# Altium schematic sheet Bank35.SchDoc
size A3; SheetNumber: 8; SheetTotal: 9
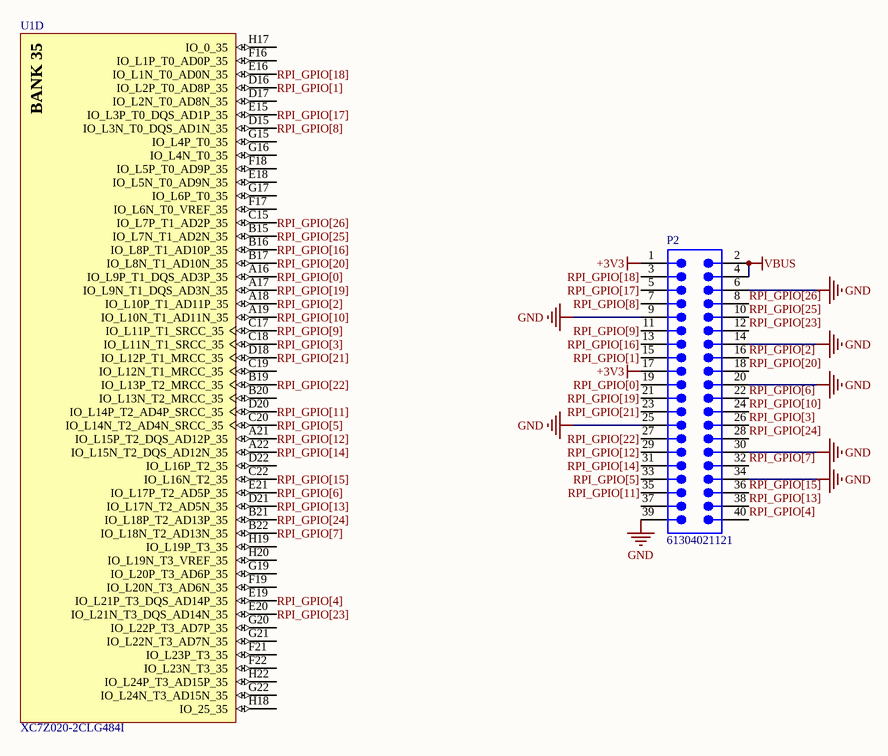
[diagram p0: Bank35.SchDoc]

## Parts
P2  61304021121  [61304021121]
U1  XC7Z020-2CLG484I  [CLG484]  (part D of 10)

## Nets
+3V3: P2.1 P2.17
GND: P2.6 P2.9 P2.14 P2.20 P2.25 P2.30 P2.34 P2.39
VBUS: P2.2 P2.4
RPI_GPIO[0]: P2.19 U1.A16(IO_L9P_T1_DQS_AD3P_35)
RPI_GPIO[1]: P2.15 U1.D16(IO_L2P_T0_AD8P_35)
RPI_GPIO[2]: P2.16 U1.A18(IO_L10P_T1_AD11P_35)
RPI_GPIO[3]: P2.26 U1.C18(IO_L11N_T1_SRCC_35)
RPI_GPIO[4]: P2.40 U1.E19(IO_L21P_T3_DQS_AD14P_35)
RPI_GPIO[5]: P2.33 U1.C20(IO_L14N_T2_AD4N_SRCC_35)
RPI_GPIO[6]: P2.22 U1.E21(IO_L17P_T2_AD5P_35)
RPI_GPIO[7]: P2.32 U1.B22(IO_L18N_T2_AD13N_35)
RPI_GPIO[8]: P2.7 U1.D15(IO_L3N_T0_DQS_AD1N_35)
RPI_GPIO[9]: P2.11 U1.C17(IO_L11P_T1_SRCC_35)
RPI_GPIO[10]: P2.24 U1.A19(IO_L10N_T1_AD11N_35)
RPI_GPIO[11]: P2.35 U1.D20(IO_L14P_T2_AD4P_SRCC_35)
RPI_GPIO[12]: P2.29 U1.A21(IO_L15P_T2_DQS_AD12P_35)
RPI_GPIO[13]: P2.38 U1.D21(IO_L17N_T2_AD5N_35)
RPI_GPIO[14]: P2.31 U1.A22(IO_L15N_T2_DQS_AD12N_35)
RPI_GPIO[15]: P2.36 U1.C22(IO_L16N_T2_35)
RPI_GPIO[16]: P2.13 U1.B16(IO_L8P_T1_AD10P_35)
RPI_GPIO[17]: P2.5 U1.E15(IO_L3P_T0_DQS_AD1P_35)
RPI_GPIO[18]: P2.3 U1.E16(IO_L1N_T0_AD0N_35)
RPI_GPIO[19]: P2.21 U1.A17(IO_L9N_T1_DQS_AD3N_35)
RPI_GPIO[20]: P2.18 U1.B17(IO_L8N_T1_AD10N_35)
RPI_GPIO[21]: P2.23 U1.D18(IO_L12P_T1_MRCC_35)
RPI_GPIO[22]: P2.27 U1.B19(IO_L13P_T2_MRCC_35)
RPI_GPIO[23]: P2.12 U1.E20(IO_L21N_T3_DQS_AD14N_35)
RPI_GPIO[24]: P2.28 U1.B21(IO_L18P_T2_AD13P_35)
RPI_GPIO[25]: P2.10 U1.B15(IO_L7N_T1_AD2N_35)
RPI_GPIO[26]: P2.8 U1.C15(IO_L7P_T1_AD2P_35)

Not connected (* = marked no-connect by the designer): P2 37; U1 B20(IO_L13N_T2_MRCC_35) C19(IO_L12N_T1_MRCC_35) D17(IO_L2N_T0_AD8N_35) D22(IO_L16P_T2_35) E18(IO_L5N_T0_AD9N_35) F16(IO_L1P_T0_AD0P_35) F17(IO_L6N_T0_VREF_35) F18(IO_L5P_T0_AD9P_35) F19(IO_L20N_T3_AD6N_35) F21(IO_L23P_T3_35) F22(IO_L23N_T3_35) G15(IO_L4P_T0_35) G16(IO_L4N_T0_35) G17(IO_L6P_T0_35) G19(IO_L20P_T3_AD6P_35) G20(IO_L22P_T3_AD7P_35) G21(IO_L22N_T3_AD7N_35) G22(IO_L24N_T3_AD15N_35) H17(IO_0_35) H18(IO_25_35) H19(IO_L19P_T3_35) H20(IO_L19N_T3_VREF_35) H22(IO_L24P_T3_AD15P_35)

## Notes on the sheet
- (in symbol CMP-0363-00013-3, part D) BANK 35

## Library data of the parts
P2 = CMP-1502-01135-2
U1 = CMP-0363-00013-3: 733 MHz Zynq™-7000 AP SoC, 130 PS I/O, 200 FPGA I/O, 484-Ball BGA, Speed Grade 2, Industrial Grade, Pb-Free; Speed Grade: -2; Flip Flops: 106400; LUTs: 53200; Extensible Block RAM (# 36Kb Blocks): 560 KB (140); ComponentLink3URL: http://www.xilinx.com/support/documentation/data_sheets/ds187-XC7Z010-XC7Z020-Data-Sheet.pdf; PackageReference: CLG484; Code_JEDEC: MO-275-PPAA-2; ComponentLink2URL: http://www.xilinx.com/support/documentation/user_guides/ug865-Zynq-7000-Pkg-Pinout.pdf; ComponentLink2Description: Package Specification; ComponentLink6URL: http://www.xilinx.com/support/documentation/user_guides/ug483_7Series_PCB.pdf; PackageVersion: Rev 1.1, 09/2012; DatasheetVersion: v1.2; PartNumber: XC7Z020-2CLG484I; ComponentLink3Description: DC and AC Switching Characteristics; PackageDescription: Wire-Bond Chip-Scale BGA, Body 19 x 19 mm, 0.8 mm Pitch; RoHS: Pb-Free; ComponentLink5URL: http://www.xilinx.com/support/documentation/user_guides/ug865-Zynq-7000-Pkg-Pinout.pdf; ComponentLink1URL: http://www.xilinx.com/support/documentation/data_sheets/ds190-Zynq-7000-Overview.pdf; ComponentLink4Description: Package File; Generic Part Number: XC7Z020; Mounting Technology: Surface Mount; ComponentLink1Description: Datasheet; ComponentLink4URL: http://www.xilinx.com/support/packagefiles/z7packages/xc7z020clg484pkg.txt; ComponentLink6Description: PCB and Layout Guide; ComponentLink5Description: Packaging and Pinout